# EAGLE design DNVT (EAGLE 9.6.2)
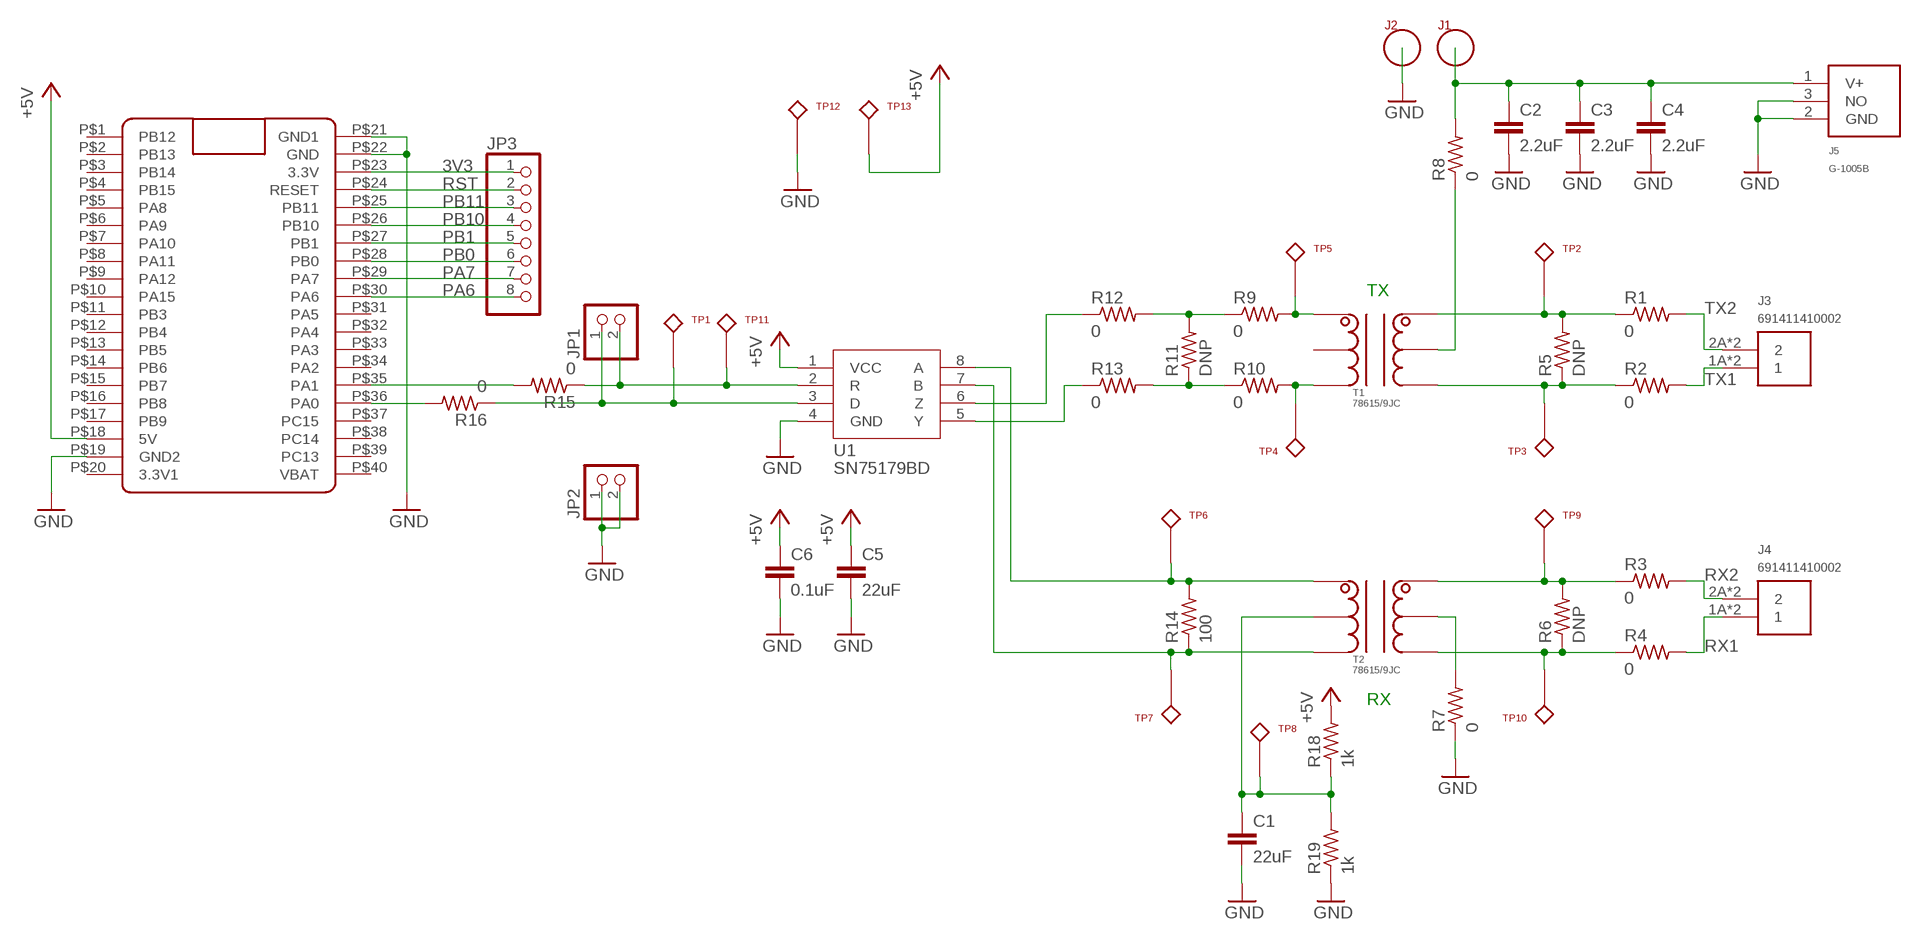
[diagram p0: schematic, sheet 1]

## Parts
C1  22uF  1210_CAPACITOR  [1210]
C2  2.2uF  1210_CAPACITOR  [1210]
C3  2.2uF  1210_CAPACITOR  [1210]
C4  2.2uF  1210_CAPACITOR  [1210]
C5  22uF  1210_CAPACITOR  [1210]
C6  0.1uF  0603_CAPACITOR  [0603]
J1  BANANA  [BANANA]
J2  BANANA  [BANANA]
J3  691411410002  [691411410002]
J4  691411410002  [691411410002]
J5  G-1005B  [G-1005B]
JP1  PINHD-1X2  [1X02]
JP2  PINHD-1X2  [1X02]
JP3  PINHD-1X8  [1X08]
R1  0  R-US_R0805  [R0805]
R2  0  R-US_R0805  [R0805]
R3  0  R-US_R0805  [R0805]
R4  0  R-US_R0805  [R0805]
R5  DNP  R-US_R0805  [R0805]
R6  DNP  R-US_R0805  [R0805]
R7  0  R-US_R0805  [R0805]
R8  0  R-US_R0805  [R0805]
R9  0  R-US_R0805  [R0805]
R10  0  R-US_R0805  [R0805]
R11  DNP  R-US_R0805  [R0805]
R12  0  R-US_R0805  [R0805]
R13  0  R-US_R0805  [R0805]
R14  100  R-US_R0805  [R0805]
R15  0  0603_RESISTOR  [0603]
R16  0  0603_RESISTOR  [0603]
R18  1k  0603_RESISTOR  [0603]
R19  1k  0603_RESISTOR  [0603]
T1  78615/9JC  [786]
T2  78615/9JC  [786]
TP1  5001  [5001]
TP2  5002  [5001]
TP3  5002  [5001]
TP4  5002  [5001]
TP5  5002  [5001]
TP6  5002  [5001]
TP7  5002  [5001]
TP8  5002  [5001]
TP9  5002  [5001]
TP10  5002  [5001]
TP11  5001  [5001]
TP12  5001  [5001]
TP13  5001  [5001]
U1  SN75179BD  [SOIC8]
U$1  BLUE_PILL  [BLUE_PILL]

## Nets
3V3: JP3.1 U$1.P$23(3.3V)
+5V: C5.1 C6.1 R18.2 TP13.P$1 U1.1(VCC) U$1.P$18(5V)
GND: C1.2 C2.2 C3.2 C4.2 C5.2 C6.2 J2.P$1 J5.2(GND) J5.3(NO) JP2.1 JP2.2 R7.1 R19.1 TP12.P$1 U1.4(GND) U$1.P$19(GND2) U$1.P$21(GND1) U$1.P$22(GND)
N$1: R1.1 R5.2 T1.6 TP2.P$1
N$2: R2.1 R5.1 T1.4 TP3.P$1
N$3: R3.1 R6.2 T2.6 TP9.P$1
N$4: R4.1 R6.1 T2.4 TP10.P$1
N$5: R7.2 T2.5
N$6: R8.1 T1.5
N$7: C1.1 R18.1 R19.2 T2.2 TP8.P$1
N$8: R14.1 T2.3 TP7.P$1 U1.7(B)
N$9: R14.2 T2.1 TP6.P$1 U1.8(A)
N$10: R9.2 T1.1 TP5.P$1
N$11: R10.2 T1.3 TP4.P$1
N$12: R9.1 R11.2 R12.2
N$13: R10.1 R11.1 R13.2
N$14: R12.1 U1.6(Z)
N$15: R13.1 U1.5(Y)
N$18: JP1.2 R15.1 TP11.P$1 U1.2(R)
N$19: C2.1 C3.1 C4.1 J1.P$1 J5.1(V+) R8.2
N$20: JP1.1 R16.1 TP1.P$1 U1.3(D)
N$21: R15.2 U$1.P$35(PA1)
N$22: R16.2 U$1.P$36(PA0)
PA6: JP3.8 U$1.P$30(PA6)
PA7: JP3.7 U$1.P$29(PA7)
PB0: JP3.6 U$1.P$28(PB0)
PB1: JP3.5 U$1.P$27(PB1)
PB10: JP3.4 U$1.P$26(PB10)
PB11: JP3.3 U$1.P$25(PB11)
RST: JP3.2 U$1.P$24(RESET)
RX1: J4.1A J4.1B R4.2
RX2: J4.2A J4.2B R3.2
TX1: J3.1A J3.1B R2.2
TX2: J3.2A J3.2B R1.2
Unconnected: T1.2 U$1.P$1(PB12) U$1.P$2(PB13) U$1.P$3(PB14) U$1.P$4(PB15) U$1.P$5(PA8) U$1.P$6(PA9) U$1.P$7(PA10) U$1.P$8(PA11) U$1.P$9(PA12) U$1.P$10(PA15) U$1.P$11(PB3) U$1.P$12(PB4) U$1.P$13(PB5) U$1.P$14(PB6) U$1.P$15(PB7) U$1.P$16(PB8) U$1.P$17(PB9) U$1.P$20(3.3V1) U$1.P$31(PA5) U$1.P$32(PA4) U$1.P$33(PA3) U$1.P$34(PA2) U$1.P$37(PC15) U$1.P$38(PC14) U$1.P$39(PC13) U$1.P$40(VBAT)

## Notes on the sheet
- TX
- RX

## Library data of the parts
C1-C5 = ruark2:1210_CAPACITOR: NO VALUE
C6 = ruark2:0603_CAPACITOR: 0603 Capacitor -- WARNING: NO DEFINED VALUE OR PART NUMBER; VALUE: sel
J1 J2 = ruark2:BANANA: JACK NON-INSULATED .218" Banana; PARTNO: 36-575-4-ND
J3 J4 = ruark2:691411410002: 2 Position Wire to Board Terminal Block Horizontal with Board 0.300" (7.62mm) Through Hole; PARTNO: 732-11084-ND
J5 = ruark2:G-1005B: Power Barrel Connector Jack 2.50mm ID (0.098"), 5.50mm OD (0.217") Through Hole, Right Angle; PARTNO: 1939-G-1005B-ND
JP1 JP2 = pinhead:PINHD-1X2: PIN HEADER
JP3 = pinhead:PINHD-1X8: PIN HEADER
R1-R14 = rcl:R-US_: RESISTOR, American symbol; SPICEPREFIX: R
R15 R16 R18 R19 = ruark2:0603_RESISTOR: 0603 Resistor -- WARNING: NO DEFINED PART NUMBER OR VALUE; VALUE: sel
T1 T2 = ruark2:78615/9JC: 10mH General Purpose Pulse Transformer 1CT:1CT Surface Mount 56Vus; PARTNO: 811-2423-ND
TP1 TP11-TP13 = ruark2:5001: Black PC Test Point, Miniature Phosphor Bronze, Silver Plating 0.040" (1.02mm) Hole Diameter Mounting Type; PARTNO: 36-5001-ND
TP2-TP10 = ruark2:5002: White PC Test Point, Miniature Phosphor Bronze, Silver Plating 0.040" (1.02mm) Hole Diameter Mounting Type; PARTNO: 36-5002-ND
U1 = ruark2:SN75179BD: 1/1 Transceiver Full RS422, RS485 8-SOIC 5V; PARTNO: 296-6860-5-ND
U$1 = BluePill:BLUE_PILL

## Board
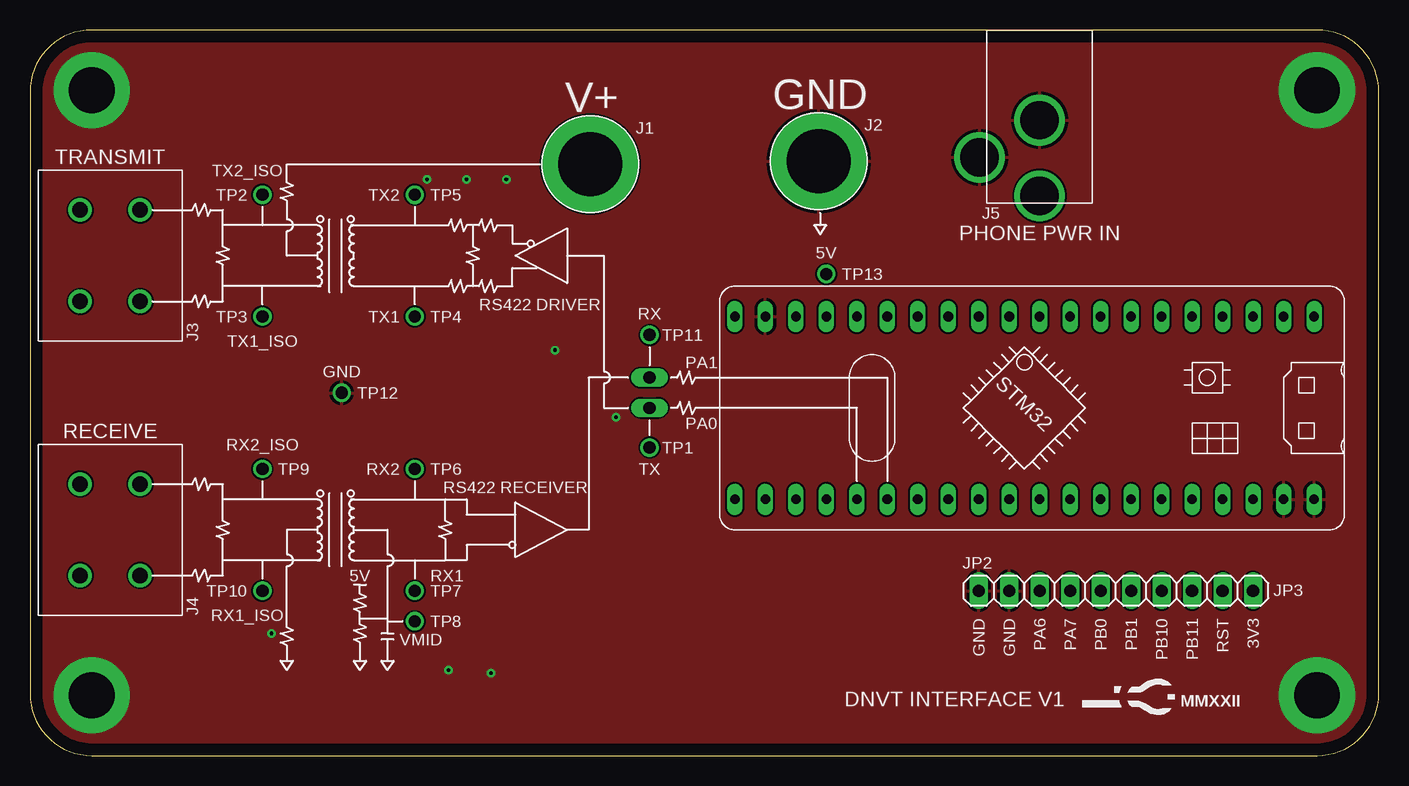
[diagram p1: board, top side]
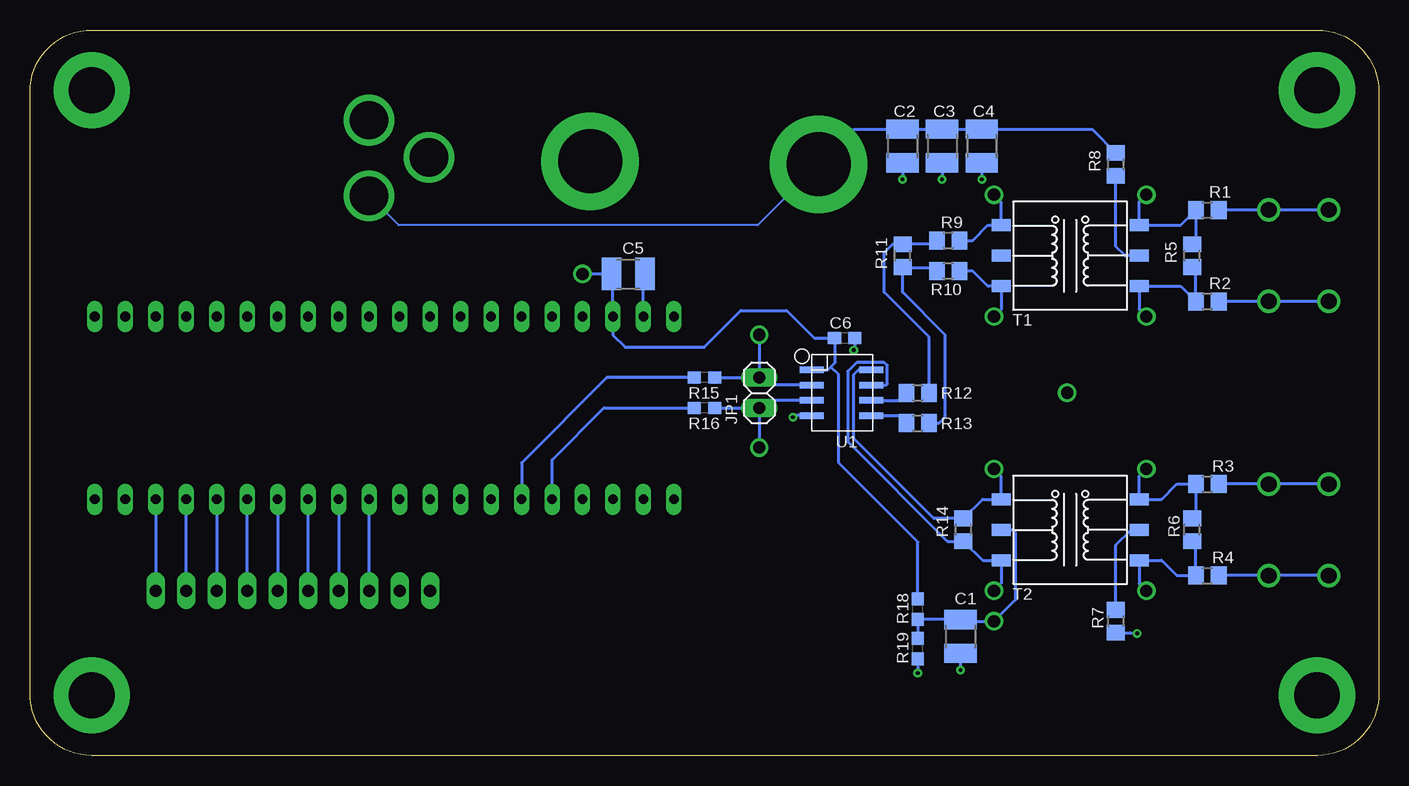
[diagram p2: board, bottom side, seen from below]

Size 112.4 x 60.5 mm. Coordinates in mm from the lower left corner, seen from the top.
Outline: 0,55.35 0,5.15 arc90 5.15,0 107.25,0 arc90 112.4,5.15 112.4,55.35 arc90 107.25,60.5 5.15,60.5 arc90 0,55.35
Copper layers (1*16): Top 0.035mm / dielectric 1.5mm / Bottom 0.035mm
Design rules "default *": minimum track width 6mil, minimum drill 12mil, track to track 6mil, track to pad 6mil, pad to pad 6mil, via to via 6mil, smd to smd 6mil, copper to edge 40mil, drill to drill 6mil, minimum pad ring 10mil, minimum via ring 8mil, stop-mask expansion 4mil, vias tented up to drill 0mil, thermal gap 10mil

### Footprints (pad centres in the part's own frame; a part is rotated, then mirrored left to right if it is on the bottom)
1210 = smd 1.6 x 2.7: 1 -1.4,0; 2 1.4,0
0603 = smd 1.1 x 1: 1 -0.85,0; 2 0.85,0
BANANA = drill 5.334 pad 8.128: P$1 0,0
691411410002 = drill 1.3: 1A -3.81,2.5; 1B -3.81,-2.5; 2A 3.81,2.5; 2B 3.81,-2.5
G-1005B = drill 3.2: 1 0,13.8; 2 0,7.5; 3 5,10.6
1X02 = drill 1.016 long: 1 -1.27,0; 2 1.27,0
1X08 = drill 1.016 long: 1 -8.89,0; 2 -6.35,0; 3 -3.81,0; 4 -1.27,0; 5 1.27,0; 6 3.81,0; 7 6.35,0; 8 8.89,0
R0805 = smd 1.3 x 1.5: 1 -0.95,0; 2 0.95,0
786 = smd 1.6 x 1: 1 -5.75,2.54; 2 -5.75,0; 3 -5.75,-2.54; 4 5.75,-2.54; 5 5.75,0; 6 5.75,2.54
5001 = drill 1.016: P$1 0,0
SOIC8 = smd 1.981 x 0.533: 1 -2.477,1.905; 2 -2.477,0.635; 3 -2.477,-0.635; 4 -2.477,-1.905; 5 2.477,-1.905; 6 2.477,-0.635; 7 2.477,0.635; 8 2.477,1.905
BLUE_PILL = drill 0.8 long: P$1 -7.62,15.24; P$2 -7.62,12.7; P$3 -7.62,10.16; P$4 -7.62,7.62; P$5 -7.62,5.08; P$6 -7.62,2.54; P$7 -7.62,0; P$8 -7.62,-2.54; P$9 -7.62,-5.08; P$10 -7.62,-7.62; P$11 -7.62,-10.16; P$12 -7.62,-12.7; P$13 -7.62,-15.24; P$14 -7.62,-17.78; P$15 -7.62,-20.32; P$16 -7.62,-22.86; P$17 -7.62,-25.4; P$18 -7.62,-27.94; P$19 -7.62,-30.48; P$20 -7.62,-33.02; P$21 7.62,15.24; P$22 7.62,12.7; P$23 7.62,10.16; P$24 7.62,7.62; P$25 7.62,5.08; P$26 7.62,2.54; P$27 7.62,0; P$28 7.62,-2.54; P$29 7.62,-5.08; P$30 7.62,-7.62; P$31 7.62,-10.16; P$32 7.62,-12.7; P$33 7.62,-15.24; P$34 7.62,-17.78; P$35 7.62,-20.32; P$36 7.62,-22.86; P$37 7.62,-25.4; P$38 7.62,-27.94; P$39 7.62,-30.48; P$40 7.62,-33.02

### Placement (x,y rotation side)
C1  34.86,9.93 270 bottom
C2  39.69,50.82 270 bottom
C3  36.39,50.82 270 bottom
C4  33.09,50.82 270 bottom
C5  62.55,40.16 0 bottom
C6  44.52,34.82 0 bottom
J1  46.68,49.3 0 top
J2  65.73,49.55 0 top
J3  6.67,41.68 90 top
J4  6.67,18.82 90 top
J5  84.14,60.48 180 top
JP1  51.63,30.25 90 bottom
JP2  80.33,13.74 0 top
JP3  93.03,13.74 180 top
R1  14.29,45.49 0 bottom
R2  14.29,37.87 0 bottom
R3  14.29,22.63 0 bottom
R4  14.29,15.01 0 bottom
R5  15.56,41.68 90 bottom
R6  15.56,18.82 90 bottom
R7  21.91,11.2 90 bottom
R8  21.91,49.3 90 bottom
R9  35.88,42.95 0 bottom
R10  35.88,40.41 0 bottom
R11  39.69,41.68 90 bottom
R12  38.42,30.25 0 bottom
R13  38.42,27.71 0 bottom
R14  34.61,18.82 90 bottom
R15  56.2,31.52 180 bottom
R16  56.2,28.98 180 bottom
R18  38.42,12.22 90 bottom
R19  38.42,8.91 90 bottom
T1  25.72,41.68 0 bottom
T2  25.72,18.82 0 bottom
TP1  51.63,25.68 0 top
TP2  19.37,46.76 0 top
TP3  19.37,36.6 0 top
TP4  32.07,36.6 0 top
TP5  32.07,46.76 0 top
TP6  32.07,23.9 0 top
TP7  32.07,13.74 0 top
TP8  32.07,11.2 0 top
TP9  19.37,23.9 0 top
TP10  19.37,13.74 0 top
TP11  51.63,35.08 0 top
TP12  25.97,30.25 0 top
TP13  66.36,40.16 0 top
U1  44.77,30.25 0 bottom
U$1  91.76,28.98 270 top

### Tracks (layer width: path | path; a pad name or v marks a point on that pad's centre or on a via)
3V3
  Bottom 0.254: U$1.P$23 JP3.1
+5V
  Bottom 0.254: U1.1 45.91,32.16 45.66,32.41 | 45.66,32.41 45.28,32.79 45.28,34.73 C6.1 47.06,34.82 49.34,37.11 53.15,37.11 56.2,34.06 62.8,34.06 63.82,35.08 U$1.P$18 63.82,40.03 C5.1 TP13.P$1 | R18.2 38.42,17.8 45.02,24.41 45.02,31.77 45.66,32.41
GND  (via drill 0.3, 3.81 pad 6.35)
  Bottom 0.254: R7.1 20.71,10.25 v20.13,10.18 | C6.2 43.67,33.89 v43.75,33.81 | U1.4 48.71,28.34 v48.83,28.22 | C2.2 v39.69,48.03 | C3.2 v36.39,48.03 | C4.2 v33.09,48.03 | U$1.P$19 61.28,40.03 C5.2 | R19.1 v38.42,6.88 | C1.2 v34.86,7.14
  other vias: 5.15,55.48 5.15,5.02 107.25,55.48 107.25,5.02
  pour Top: 0.2,54.25 0.2,55.1 arc-90 5.35,60.25 107.05,60.25 arc-90 112.2,55.1 112.2,5.4 arc-90 107.05,0.25 5.35,0.25 arc-90 0.2,5.4
N$1
  Bottom 0.254: R5.2 15.24,42.95 R1.1 16.51,44.22 T1.6 19.97,46.16 TP2.P$1
N$2
  Bottom 0.254: R5.1 15.24,40.41 R2.1 16.51,39.14 T1.4 19.97,37.2 TP3.P$1
N$3
  Bottom 0.254: TP9.P$1 19.97,23.3 T2.6 18.1,21.36 16.83,22.63 R3.1 15.24,20.09 R6.2
N$4
  Bottom 0.254: TP10.P$1 19.97,14.34 T2.4 18.1,16.28 16.83,15.01 R4.1 15.24,17.55 R6.1
N$5
  Bottom 0.254: R7.2 21.91,17.55 20.64,18.82 T2.5
N$6
  Bottom 0.254: T1.5 21.15,41.68 21.91,42.44 R8.1
N$7
  Bottom 0.254: R19.2 R18.1 34.9,11.37 C1.1 34.73,11.2 TP8.P$1 30.29,12.98 30.29,18.57 30.55,18.82 T2.2
N$8
  Bottom 0.254: TP7.P$1 31.47,14.34 T2.3 33.02,16.28 R14.1 35.95,17.87 44.26,26.19 44.26,32.03 43.5,32.79 41.21,32.79 40.96,32.54 40.96,31.01 41.09,30.89 U1.7
N$9
  Bottom 0.254: TP6.P$1 31.47,23.3 T2.1 33.02,21.36 R14.2 37.08,19.77 43.75,26.44 43.75,31.77 43.37,32.16 U1.8
N$10
  Bottom 0.254: R9.2 33.85,42.95 32.58,44.22 T1.1 31.47,46.16 TP5.P$1
N$11
  Bottom 0.254: R10.2 33.85,40.41 32.58,39.14 T1.3 31.47,37.2 TP4.P$1
N$12
  Bottom 0.254: R12.2 37.47,34.89 41.21,38.63 41.21,41.93 40.52,42.63 R11.2 37.15,42.63 R9.1
N$13
  Bottom 0.254: R13.2 36.64,27.71 36.13,28.22 36.13,35.08 39.69,38.63 39.69,40.66 | 39.69,40.66 R11.1 | R10.1 37.08,40.66 39.69,40.66
N$14
  Bottom 0.254: U1.6 40.01,29.61 R12.1
N$15
  Bottom 0.254: U1.5 40.01,28.34 R13.1
N$18
  Bottom 0.254: U1.2 50.99,30.89 JP1.2 | TP11.P$1 JP1.2 | R15.1 JP1.2
N$19
  Bottom 0.152: J1.P$1 51.76,44.22 81.68,44.22 J5.1
  Bottom 0.254: J1.P$1 43.75,52.22 C2.1 C3.1 C4.1 23.88,52.22 R8.2
N$20
  Bottom 0.254: U1.3 50.99,29.61 JP1.1 51.63,28.73 | 51.63,28.73 TP1.P$1 | R16.1 51.88,28.98 51.63,28.73
N$21
  Bottom 0.254: R15.2 64.33,31.52 71.44,24.41 U$1.P$35
N$22
  Bottom 0.254: U$1.P$36 68.9,24.66 64.58,28.98 R16.2
PA6
  Bottom 0.254: JP3.8 U$1.P$30
PA7
  Bottom 0.254: U$1.P$29 JP3.7
PB0
  Bottom 0.254: JP3.6 U$1.P$28
PB1
  Bottom 0.254: U$1.P$27 JP3.5
PB10
  Bottom 0.254: JP3.4 U$1.P$26
PB11
  Bottom 0.254: U$1.P$25 JP3.3
RST
  Bottom 0.254: JP3.2 U$1.P$24
RX1
  Bottom 0.254: J4.1A J4.1B R4.2
RX2
  Bottom 0.254: J4.2A J4.2B R3.2
TX1
  Bottom 0.254: J3.1A J3.1B R2.2
TX2
  Bottom 0.254: J3.2A J3.2B R1.2

### Text on the board
tPlace: GND | V+ | TRANSMIT | TX2_ISO | TX2 | PHONE PWR IN | 5V | RS422 DRIVER | TX1 | RX | TX1_ISO | PA1 | GND | PA0 | RECEIVE | RX2_ISO | RX2 | TX | RS422 RECEIVER | RX1 | 5V | RX1_ISO | GND | GND | PA6 | PA7 | PB0 | PB1 | PB10 | PB11 | RST | 3V3 | VMID | DNVT INTERFACE V1 | MMXXII
tStop: 031